# Altium schematic sheet 龙邱MIC转接板.SchDoc
size A4
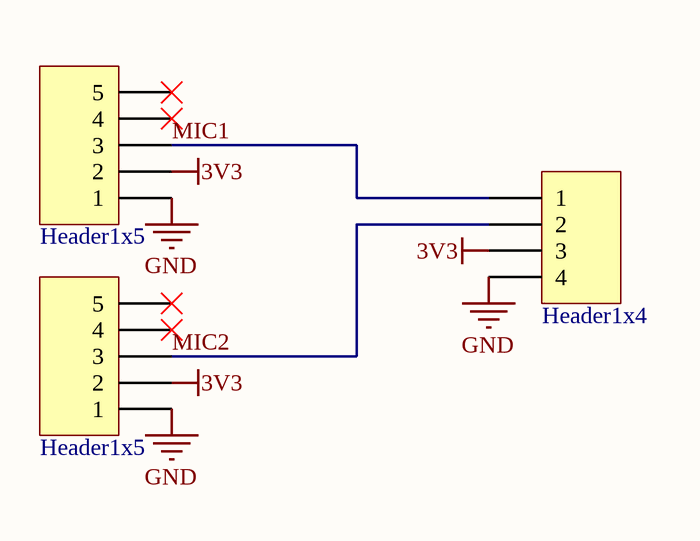
[diagram p0: 龙邱MIC转接板.SchDoc]

## Parts
(Parts that share a designator on the sheet are numbered #1, #2 ... from top to bottom, then left to right.)
?#1  Header1x5  [HEADER1X5]
?#2  Header1x4  [HEADER1X4]
?#3  Header1x5  [HEADER1X5]

## Nets
3V3: ?#1.2 ?#2.3 ?#3.2
GND: ?#1.1 ?#2.4 ?#3.1
MIC1: ?#1.3 ?#2.1
MIC2: ?#2.2 ?#3.3

Not connected (* = marked no-connect by the designer): ?#1 4* 5*; ?#3 4* 5*